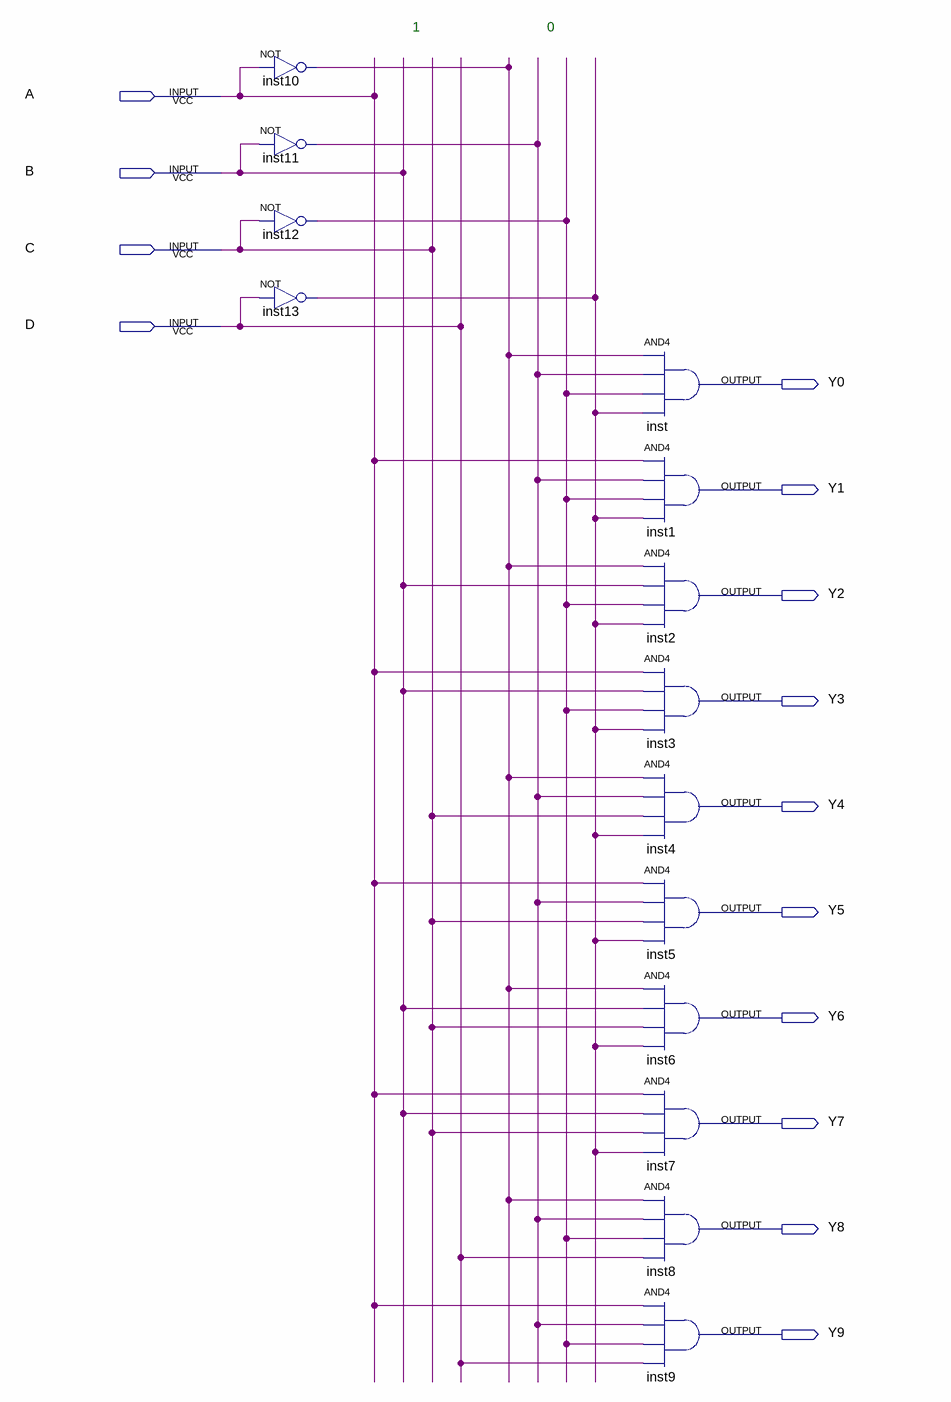
[diagram p0: schematic sheet]
// Quartus schematic BCD_to_decimal_decoder.bdf as structural Verilog: 14 symbols, 14 pins
module BCD_to_decimal_decoder (
  input  A,
  input  B,
  input  C,
  input  D,
  output Y0,
  output Y1,
  output Y2,
  output Y3,
  output Y4,
  output Y5,
  output Y6,
  output Y7,
  output Y8,
  output Y9
);

  wire inst10_out, inst11_out, inst12_out, inst13_out;

  not inst10 (inst10_out, A);
  not inst11 (inst11_out, B);
  not inst12 (inst12_out, C);
  not inst13 (inst13_out, D);
  and inst (Y0, inst10_out, inst11_out, inst12_out, inst13_out);
  and inst1 (Y1, A, inst11_out, inst12_out, inst13_out);
  and inst2 (Y2, inst10_out, B, inst12_out, inst13_out);
  and inst3 (Y3, A, B, inst12_out, inst13_out);
  and inst4 (Y4, inst10_out, inst11_out, C, inst13_out);
  and inst5 (Y5, A, inst11_out, C, inst13_out);
  and inst6 (Y6, inst10_out, B, C, inst13_out);
  and inst7 (Y7, A, B, C, inst13_out);
  and inst8 (Y8, inst10_out, inst11_out, inst12_out, D);
  and inst9 (Y9, A, inst11_out, inst12_out, D);

  // Notes on the sheet:
  //   1
  //   0
endmodule
